# Altium schematic sheet PIF_robot.SchDoc
size A
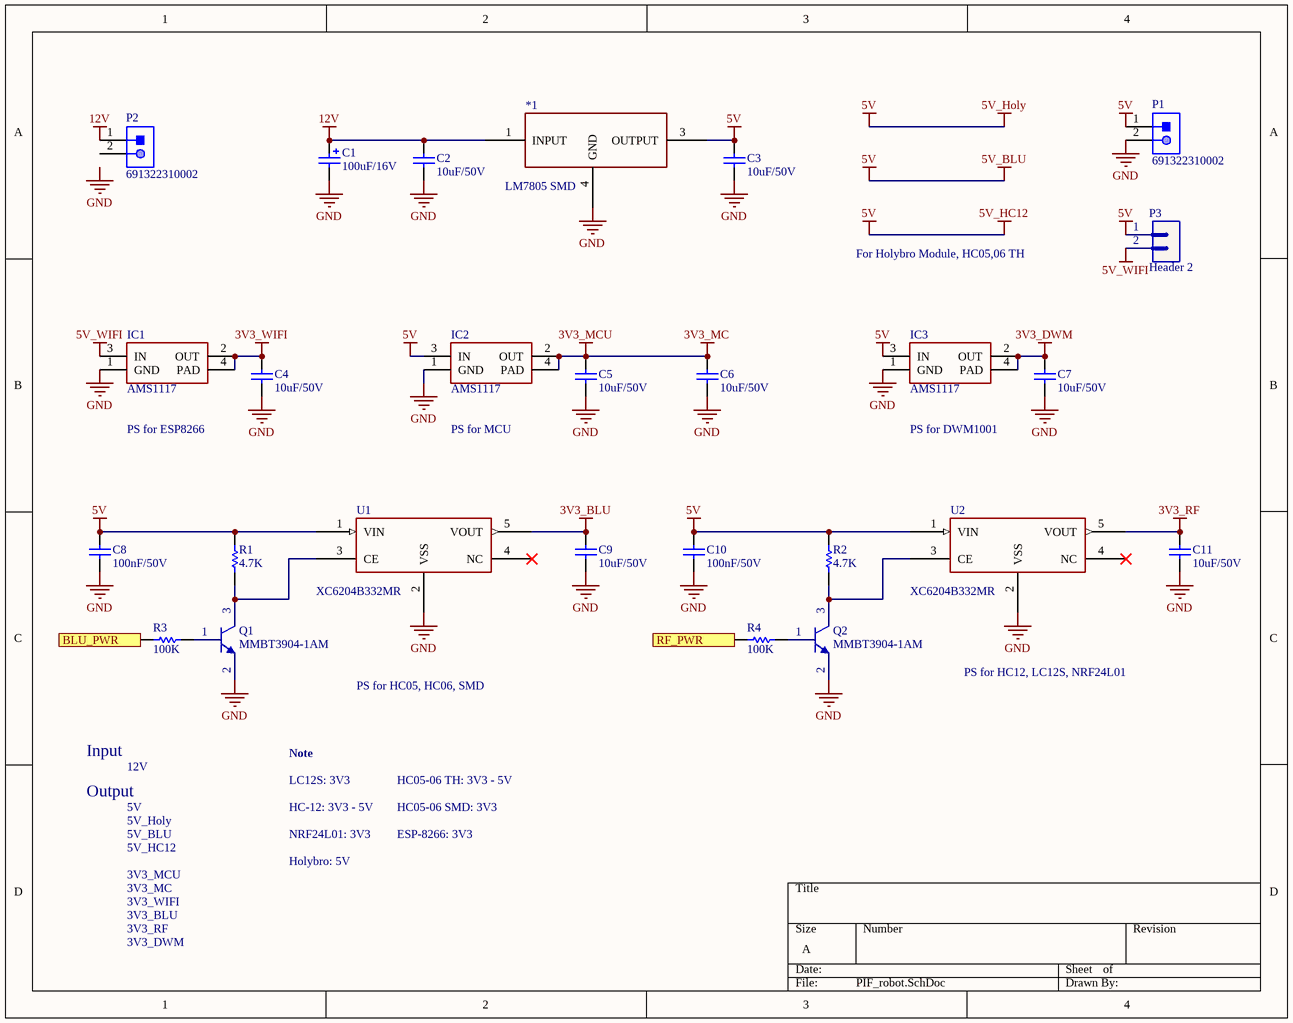
[diagram p0: PIF_robot.SchDoc]

## Parts
*1  LM7805 SMD  [LM7805 SMD]
C1  value 100uF/16V  [CAP-SM-AL-SIZE-D-D6L6]  (hidden comment: Cap-Al-100uF-16V-D6L5)
C2  value 10uF/50V  [CAP-SM-0805]  (hidden comment: Cap-10uF-50V-0805)
C3  value 10uF/50V  [CAP-SM-0805]  (hidden comment: Cap-10uF-50V-0805)
C4  value 10uF/50V  [CAP-SM-0805]  (hidden comment: Cap-10uF-50V-0805)
C5  value 10uF/50V  [CAP-SM-0805]  (hidden comment: Cap-10uF-50V-0805)
C6  value 10uF/50V  [CAP-SM-0805]  (hidden comment: Cap-10uF-50V-0805)
C7  value 10uF/50V  [CAP-SM-0805]  (hidden comment: Cap-10uF-50V-0805)
C8  value 100nF/50V  [CAP-SM-0805]  (hidden comment: Cap-100nF-50V-0805)
C9  value 10uF/50V  [CAP-SM-0805]  (hidden comment: Cap-10uF-50V-0805)
C10  value 100nF/50V  [CAP-SM-0805]  (hidden comment: Cap-100nF-50V-0805)
C11  value 10uF/50V  [CAP-SM-0805]  (hidden comment: Cap-10uF-50V-0805)
IC1  AMS1117  [SOT223]
IC2  AMS1117  [SOT223]
IC3  AMS1117  [SOT223]
P1  691322310002  [691322310002]
P2  691322310002  [691322310002]
P3  Header 2  [JP2]
Q1  MMBT3904-1AM  [SOT23_NEX]
Q2  MMBT3904-1AM  [SOT23_NEX]
R1  value 4.7K  [RES-SM-0805]  (hidden comment: Res-4.7K-0805)
R2  value 4.7K  [RES-SM-0805]  (hidden comment: Res-4.7K-0805)
R3  value 100K  [RES-SM-0805]  (hidden comment: Res-100K-0805)
R4  value 100K  [RES-SM-0805]  (hidden comment: Res-100K-0805)
U1  XC6204B332MR  [XC6204/05_SOT-00]
U2  XC6204B332MR  [XC6204/05_SOT-00]

## Ports
BLU_PWR (in), RF_PWR (in)

## Nets
3V3_BLU: C9.2 U1.5(VOUT)
3V3_DWM: C7.2 IC3.2(OUT) IC3.4(PAD)
3V3_MC: C5.2 C6.2 IC2.2(OUT) IC2.4(PAD)  [also labelled 3V3_MCU]
3V3_RF: C11.2 U2.5(VOUT)
3V3_WIFI: C4.2 IC1.2(OUT) IC1.4(PAD)
5V: *1.3(OUTPUT) C3.2 C8.2 C10.2 IC2.3(IN) IC3.3(IN) P1.1 P3.1 R1.2 R2.2 U1.1(VIN) U2.1(VIN)  [also labelled 5V_BLU, 5V_HC12, 5V_Holy]
5V_WIFI: IC1.3(IN) P3.2
12V: *1.1(INPUT) C1.1 C2.1 P2.1
GND: *1.4(GND) C1.2 C2.2 C3.1 C4.1 C5.1 C6.1 C7.1 C8.1 C9.1 C10.1 C11.1 IC1.1(GND) IC2.1(GND) IC3.1(GND) P1.2 Q1.2(E) Q2.2(E) U1.2(VSS) U2.2(VSS)
BLU_PWR: R3.1 ; port BLU_PWR
RF_PWR: R4.1 ; port RF_PWR
NetQ1_1: Q1.1(B) R3.2
NetQ1_3: Q1.3(C) R1.1 U1.3(CE)
NetQ2_1: Q2.1(B) R4.2
NetQ2_3: Q2.3(C) R2.1 U2.3(CE)

Not connected (* = marked no-connect by the designer): P2 2; U1 4(NC)*; U2 4(NC)*

## Notes on the sheet
- For Holybro Module, HC05,06 TH
- PS for ESP8266
- PS for MCU
- PS for DWM1001
- PS for HC05, HC06, SMD
- PS for HC12, LC12S, NRF24L01
- Input
- 12V
- Note
- Output
- 5V_Holy
- 5V_BLU
- 5V
- LC12S: 3V3
- HC-12: 3V3 - 5V
- NRF24L01: 3V3
- HC05-06 TH: 3V3 - 5V
- HC05-06 SMD: 3V3
- ESP-8266: 3V3
- 5V_HC12
- 3V3_MC
- 3V3_MCU
- 3V3_WIFI
- Holybro: 5V
- 3V3_BLU
- 3V3_RF
- 3V3_DWM
- Labels drawn without touching a wire or pin: GND

## Library data of the parts
C1 = Cap-Al-100uF-16V-D6L5: CAP ALUM 100UF 20% 16V SMD; Manufacturer: Nichicon; Manufacturer Part Number: UWX1C101MCL1GB; Local Supplier: thegioiic; Local Supplier Link: https://thegioiic.com/products/tu-nhom-smd-100uf-16v-d6-3l5-4; Supplier 1: Digikey; Supplier 1 Part Number: 493-2105-1-ND; Supplier 1 Link: https://www.digikey.com/product-detail/en/nichicon/UWX1C101MCL1GB/493-2105-1-ND/590080
C2-C7 C9 C11 = Cap-10uF-50V-0805: CAP CER 10UF 50V X5R 0805; Manufacturer: Yageo; Manufacturer Part Number: CC0805KKX5R9BB106; Local Supplier: thegioiic; Local Supplier Link: https://thegioiic.com/products/tu-10uf-50v-0805; Supplier 1: Digikey; Supplier 1 Link: https://www.digikey.com/product-detail/en/yageo/CC0805KKX5R9BB106/311-3499-2-ND/7164383; Supplier 1 Part Number: 311-3499-2-ND
C8 C10 = Cap-100nF-50V-0805: CAP CER 0.1UF 50V Y5V 0805; Manufacturer: Samsung Electro-Mechanics; Manufacturer Part Number: CL21F104ZBCNNNC; Local Supplier: thegioiic; Local Supplier Link: https://thegioiic.com/products/tu-100nf-0-1uf-50v-0805; Supplier 1: Digikey; Supplier 1 Part Number: 1276-1007-1-ND; Supplier 1 Link: https://www.digikey.com/product-detail/en/samsung-electro-mechanics/CL21F104ZBCNNNC/1276-1007-1-ND/3889093
IC1-IC3 = AMS1117: Available in 1.8V, 2.5V, 2.85V, 3.3V, 5V, and  Adjustable Versions; Value: LM317
P1 P2 = 691322310002: WR-TBL Serie 322 Horizontal PCB Header, Pluggable, pitch 3.81mm, 2p; Compliance: RoHS; Modularity: No; Pin Number: 2; Rated Current [UL]: 10A; Working Voltage [UL]: 300VAC; ComponentLink1Description: Manufacturer; ComponentLink1URL: http://www.we-online.de; ComponentLink2URL: https://katalog.we-online.de/em/datasheet/691322310002.pdf; ComponentLink2Description: Datasheet; Mounting Technology: THT; Part Number: 691322310002; Packaging: Box; Operating Temperature: -40 to +105degC; PCB/Cable/Panel: PCB; Pitch: 3.81mm; Published Date: October 2019; Type: Horizontal; Publisher: Wurth Elektronik; Application: Pluggable
P3 = Header 2: Header, 2-Pin; LatestRevisionDate: 17-Jul-2002; LatestRevisionNote: Re-released for DXP Platform.; Publisher: Altium Limited
R1 R2 = Res-4.7K-0805: RES SMD 4.7K OHM 5% 1/8W 0805; Manufacturer: Yageo; Manufacturer Part Number: RC0805JR-074K7L; Local Supplier: thegioiic; Local Supplier Link: https://thegioiic.com/products/dien-tro-4-7k-ohm-0805-5; Supplier 1: Digikey; Supplier 1 Link: https://www.digikey.com/product-detail/en/yageo/RC0805JR-074K7L/311-4.7KARCT-ND/731274; Supplier 1 Part Number: 311-4.7KARCT-ND
R3 R4 = Res-100K-0805: RES 0 OHM JUMPER 0805; Manufacturer: Vishay Dale; Manufacturer Part Number: WSL080500000ZEA9; Local Supplier: thegioiic; Local Supplier Link: https://thegioiic.com/products/dien-tro-0-ohm-0805-5; Supplier 1: Digikey; Supplier 1 Link: https://www.digikey.com/product-detail/en/vishay-dale/WSL080500000ZEA9/541-3928-1-ND/7423223; Supplier 1 Part Number: 541-3928-1-ND
U1 U2 = XC6204B332MR: Vendor: Torex Semiconductor; Built_By: EMA_UL_Team; SourceLibrary: Torex_2016-07-05_1; Manufacturer_Part_Number: XC6204B332MR; Copyright: Copyright (C) 2018 Accelerated Designs. All rights reserved; RefDes: RefDes; Type: DEV
*1 = LM7805 SMD: Local Supplier: *; Local Supplier Link: *; Local Supplier Part Number: *; Mannufacture: *; Mannufacture Part Number: *